# EAGLE design ledboard_smallcon (EAGLE 6.4)
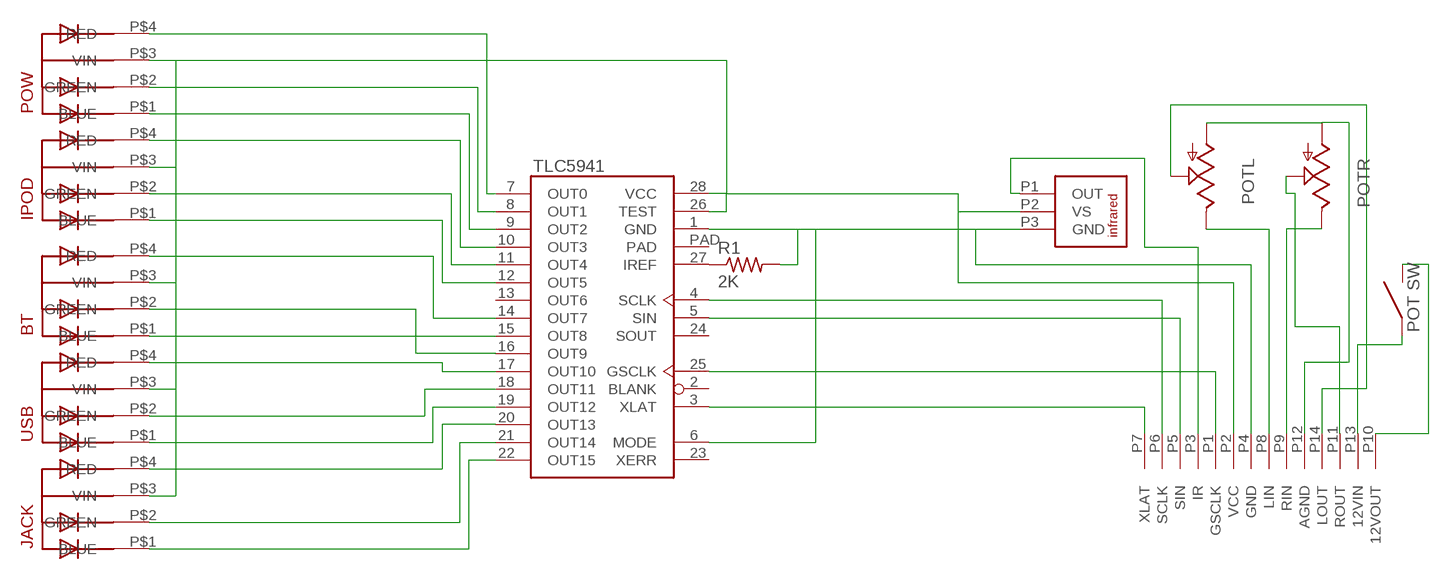
[diagram p0: schematic, sheet 1]

## Parts
BT  5MMRGBLEDBENT  [BENTLED]
IPOD  5MMRGBLEDBENT  [BENTLED]
IR  TSOP323  [TSOP323]
JACK  5MMRGBLEDBENT  [BENTLED]
POT  ALPS_RK0971221Z0N  [ALPS_RK0971221Z0X]
POW  5MMRGBLEDBENT  [BENTLED]
R1  2K  R-US_0207/7  [0207/7]
U$1  TLC5941  [HTSSOP28_POWERPAD]
U$3  CONNECTORSMALL  [CON2]
USB  5MMRGBLEDBENT  [BENTLED]

## Nets
N$1: BT.P$3(VIN) IPOD.P$3(VIN) IR.P2(VS) JACK.P$3(VIN) POW.P$3(VIN) U$1.26(TEST) U$1.28(VCC) U$3.P2(VCC) USB.P$3(VIN)
N$2: POW.P$4(RED) U$1.7(OUT0)
N$3: POW.P$2(GREEN) U$1.8(OUT1)
N$4: POW.P$1(BLUE) U$1.9(OUT2)
N$5: IPOD.P$4(RED) U$1.10(OUT3)
N$6: IPOD.P$2(GREEN) U$1.11(OUT4)
N$7: IPOD.P$1(BLUE) U$1.12(OUT5)
N$8: BT.P$4(RED) U$1.14(OUT7)
N$9: BT.P$1(BLUE) U$1.15(OUT8)
N$10: U$1.19(OUT12) USB.P$1(BLUE)
N$11: JACK.P$1(BLUE) U$1.22(OUT15)
N$12: BT.P$2(GREEN) U$1.16(OUT9)
N$13: U$1.17(OUT10) USB.P$4(RED)
N$14: U$1.4(SCLK) U$3.P6(SCLK)
N$15: JACK.P$4(RED) U$1.20(OUT13)
N$16: POT.G1 POT.G2 U$3.P12(AGND)
N$17: U$1.18(OUT11) USB.P$2(GREEN)
N$18: JACK.P$2(GREEN) U$1.21(OUT14)
N$19: R1.1 U$1.27(IREF)
N$20: IR.P3(GND) R1.2 U$1.1(GND) U$1.6(MODE) U$3.P4(GND)
N$21: U$1.5(SIN) U$3.P5(SIN)
N$22: IR.P1(OUT) U$3.P3(IR)
N$23: POT.I1 U$3.P8(LIN)
N$24: U$1.25(GSCLK) U$3.P1(GSCLK)
N$25: U$1.3(XLAT) U$3.P7(XLAT)
N$26: POT.I2 U$3.P9(RIN)
N$27: POT.O1 U$3.P14(LOUT)
N$28: POT.O2 U$3.P11(ROUT)
N$29: POT.S1 U$3.P13(12VIN)
N$30: POT.S2 U$3.P10(12VOUT)
Unconnected: U$1.2(BLANK) U$1.13(OUT6) U$1.23(XERR) U$1.24(SOUT) U$1.PAD

## Library data of the parts
BT IPOD JACK POW USB = led_rgb:5MMRGBLED
IR = tsop321:TSOP323
POT = audio-pots:ALPS_RK0971221Z0*: ALPS RK0971221Z Dual-gang 9mm potentiometer for volume control, with SPST switch -05 model: 10K with "volume" taper -0N model: 50K with traditional audio taper
R1 = resistor:R-US_: RESISTOR, American symbol
U$1 = tlc594X:TLC5941
U$3 = connector:CONNECTOR

## Board
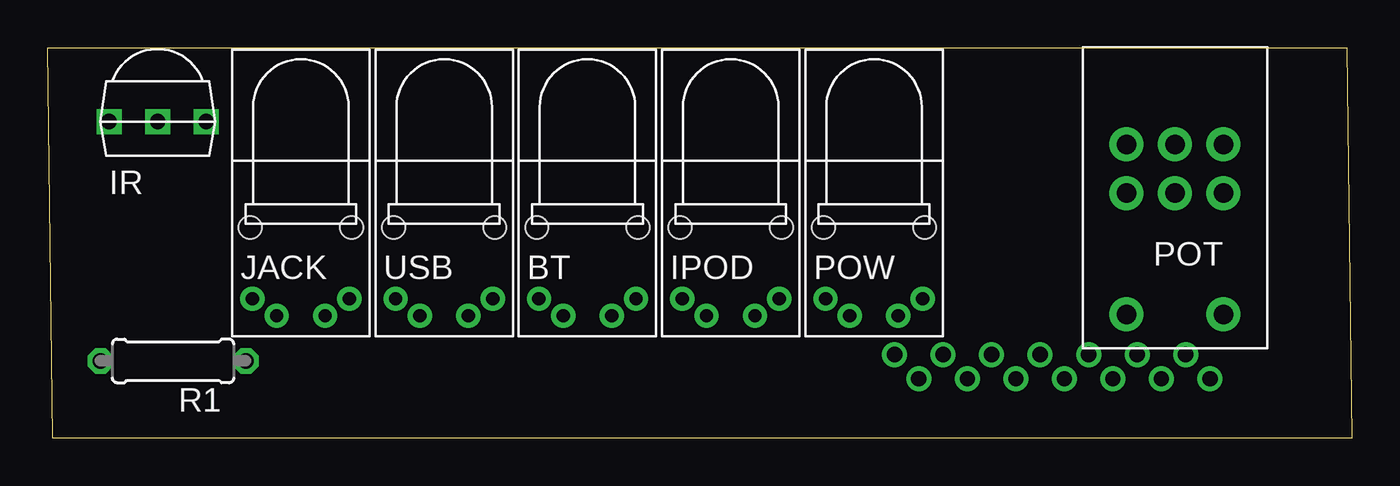
[diagram p1: board, top side]
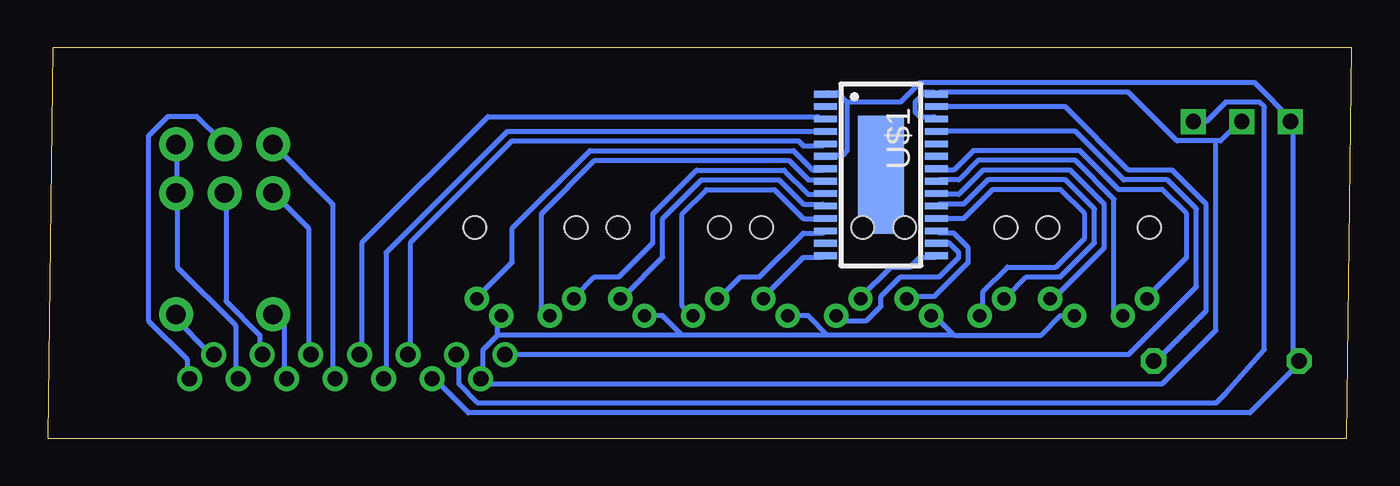
[diagram p2: board, bottom side, seen from below]

Size 68.25 x 20.43 mm. Coordinates in mm from the lower left corner, seen from the top.
Outline: 0.25,0 0,20.43 68,20.43 68.25,0 0.25,0
Copper layers (1*16): Top 0.035mm / dielectric 1.5mm / Bottom 0.035mm
Design rules "default *": minimum track width 10mil, minimum drill 24mil, track to track 8mil, track to pad 8mil, pad to pad 8mil, via to via 8mil, smd to smd 8mil, copper to edge 40mil, drill to drill 8mil, minimum pad ring 10mil, minimum via ring 8mil, stop-mask expansion 4mil, vias tented up to drill 0mil, thermal gap 10mil

### Footprints (pad centres in the part's own frame; a part is rotated, then mirrored left to right if it is on the bottom)
BENTLED = drill 0.7 pad 1.27: P$1 -2.54,-0.381; P$2 -1.27,-1.27; P$3 1.27,-1.27; P$4 2.54,-0.381 | hole 1.2: -2.65,3.35; 2.65,3.35
TSOP323 = drill 0.8 square: P1 2.54,0; P2 0,0; P3 -2.54,0
ALPS_RK0971221Z0X = drill 1.016 pad 1.778: G1 2.54,-2.54; G2 0,-2.54; I1 2.54,2.54; I2 0,2.54; O1 2.54,0; O2 0,0; S1 -6.35,-2.54; S2 -6.35,2.54
0207/7 = drill 0.813 octagon: 1 -3.81,0; 2 3.81,0
HTSSOP28_POWERPAD = smd 0.35 x 1.2: 1 -4.225,-2.9; 2 -3.575,-2.9; 3 -2.925,-2.9; 4 -2.275,-2.9; 5 -1.625,-2.9; 6 -0.975,-2.9; 7 -0.325,-2.9; 8 0.325,-2.9; 9 0.975,-2.9; 10 1.625,-2.9; 11 2.275,-2.9; 12 2.925,-2.9; 13 3.575,-2.9; 14 4.225,-2.9; 15 4.225,2.9; 16 3.575,2.9; 17 2.925,2.9; 18 2.275,2.9; 19 1.625,2.9; 20 0.975,2.9; 21 0.325,2.9; 22 -0.325,2.9; 23 -0.975,2.9; 24 -1.625,2.9; 25 -2.275,2.9; 26 -2.925,2.9; 27 -3.575,2.9; 28 -4.225,2.9 | smd 6.17 x 2.4: PAD 0,0
CON2 = drill 0.8: P1 -10.795,1.27; P2 -9.525,0; P3 -8.255,1.27; P4 -6.985,0; P5 -5.715,1.27; P6 -4.445,0; P7 -3.175,1.27; P8 -1.905,0; P9 -0.635,1.27; P10 0.635,0; P11 1.905,1.27; P12 3.175,0; P13 4.445,1.27; P14 5.715,0

### Placement (x,y rotation side)
BT  28.25,7.68 0 top
IPOD  35.75,7.68 0 top
IR  5.75,16.57 0 top
JACK  13.25,7.68 0 top
POT  59,12.83 90 top
POW  43.25,7.68 0 top
R1  6.56,4.04 180 top
U$1  24.64,13.77 270 bottom
U$3  55.12,3.11 0 top
USB  20.75,7.68 0 top

### Tracks (layer width: path | path; a pad name or v marks a point on that pad's centre or on a via)
N$1
  Bottom 0.254: U$1.26 21.84,16.82 22.61,16.82 22.86,17.08 22.86,17.58 22.35,18.09 21.84,18.09 U$1.28 21.59,18.09 11.68,18.09 9.14,15.55 7.11,15.55 | 7.11,15.55 6.86,15.55 5.84,16.57 IR.P2 | 44.7,5.39 44.7,6.41 POW.P$3 | 44.7,5.39 45.47,4.63 45.47,3.11 | JACK.P$3 15.24,6.41 16.26,5.39 20.83,5.39 | 20.83,5.39 21.84,6.41 USB.P$3 | BT.P$3 28.45,6.41 27.43,5.39 | 20.83,5.39 27.43,5.39 | IPOD.P$3 36.07,6.41 35.05,5.39 | 27.43,5.39 35.05,5.39 | 35.05,5.39 44.7,5.39 | 7.11,15.55 7.11,5.65 9.91,2.85 45.21,2.85 45.47,3.11 | 45.47,3.11 U$3.P2
N$2
  Bottom 0.254: U$1.7 27.69,14.03 28.19,14.03 29.21,15.04 39.88,15.04 43.94,10.98 43.94,9.2 45.72,7.42 POW.P$4
N$3
  Bottom 0.254: U$1.8 27.69,13.52 28.45,13.52 29.46,14.54 39.62,14.54 42.42,11.74 42.42,6.66 42.16,6.41 POW.P$2
N$4
  Bottom 0.254: U$1.9 27.69,12.76 28.45,12.76 29.72,14.03 34.29,14.03 36.58,11.74 36.58,10.22 38.35,8.44 39.62,8.44 40.64,7.42 POW.P$1
N$5
  Bottom 0.254: U$1.10 27.69,12.25 28.7,12.25 29.97,13.52 34.04,13.52 36.07,11.49 36.07,9.46 38.1,7.42 IPOD.P$4
N$6
  Bottom 0.254: U$1.11 27.69,11.49 28.7,11.49 30.23,13.01 33.78,13.01 35.05,11.74 35.05,6.92 34.54,6.41 IPOD.P$2
N$7
  Bottom 0.254: U$1.12 27.69,10.73 28.7,10.73 30.99,8.44 32,8.44 33.02,7.42 IPOD.P$1
N$8
  Bottom 0.254: U$1.14 27.69,9.46 28.7,9.46 30.73,7.42 BT.P$4
N$9
  Bottom 0.254: U$1.15 21.84,9.46 22.61,9.46 23.11,8.95 24.13,8.95 25.65,7.42 BT.P$1
N$10
  Bottom 0.254: U$1.19 21.59,12.25 20.32,12.25 19.05,13.52 14.99,13.52 13.46,12 13.46,10.22 15.24,8.44 17.02,8.44 18.03,7.42 USB.P$1
N$11
  Bottom 0.254: U$1.22 21.59,14.03 20.83,14.03 19.81,15.04 14.22,15.04 12.19,13.01 9.91,13.01 8.64,11.74 8.64,9.46 10.67,7.42 JACK.P$1
N$12
  Bottom 0.254: U$1.16 21.59,10.22 21.08,10.22 20.57,9.71 20.57,9.46 21.59,8.44 23.62,8.44 24.64,7.42 24.64,6.92 25.4,6.15 26.67,6.15 26.92,6.41 BT.P$2
N$13
  Bottom 0.254: U$1.17 21.59,10.73 20.83,10.73 20.07,9.96 20.07,9.2 21.84,7.42 23.11,7.42 USB.P$4
N$14
  Bottom 0.254: U$1.4 27.69,16.06 44.2,16.06 50.55,9.71 50.55,3.11 U$3.P6
N$15
  Bottom 0.254: U$1.20 21.59,12.76 20.57,12.76 19.3,14.03 14.73,14.03 12.95,12.25 12.95,9.96 15.75,7.17 JACK.P$4
N$16
  Bottom 0.254: U$3.P12 58.42,3.11 58.42,5.9 61.47,8.95 61.47,12.76 POT.G2 61.47,13.01 61.47,15.3 POT.G1
N$17
  Bottom 0.254: U$1.18 21.59,11.49 20.32,11.49 18.8,13.01 15.24,13.01 13.97,11.74 13.97,10.47 15.49,8.95 18.03,8.95 19.3,7.68 19.3,6.41 USB.P$2
N$18
  Bottom 0.254: U$1.21 21.59,13.52 20.57,13.52 19.56,14.54 14.48,14.54 12.45,12.5 12.45,6.66 12.19,6.41 JACK.P$2
N$19
  Bottom 0.254: U$1.27 21.59,17.33 14.99,17.33 11.68,14.03 9.4,14.03 7.62,12.25 7.62,6.66 10.16,4.12 R1.1
N$20
  Bottom 0.254: 3.05,16.57 5.08,18.6 22.61,18.6 23.62,17.58 26.42,17.58 | 27.43,18.09 U$1.1 | 3.05,3.61 2.79,3.87 R1.2 3.05,3.61 | 3.05,3.61 5.33,1.33 46.23,1.33 48.01,3.11 U$3.P4 | 3.05,3.61 3.05,16.57 | 3.05,16.57 IR.P3 | 26.92,14.79 26.67,14.79 26.42,15.04 26.42,17.58 | 26.42,17.58 26.92,18.09 26.92,18
  Bottom 0.305: U$1.1 26.92,18 26.83,18 | 26.92,14.79 27.5,14.79 U$1.6
N$21
  Bottom 0.254: U$1.5 27.69,15.3 28.7,15.3 28.96,15.55 43.94,15.55 49.28,10.22 49.28,4.38 U$3.P5
N$22
  Bottom 0.254: IR.P1 7.62,16.57 6.6,17.58 4.83,17.58 4.57,17.33 4.57,4.63 6.6,2.34 7.11,1.84 45.72,1.84 46.74,2.85 46.74,4.38 U$3.P3
N$23
  Bottom 0.254: U$3.P8 53.34,3.11 53.34,12.25 56.39,15.3 POT.I1
N$24
  Bottom 0.254: U$1.25 21.59,16.06 14.48,16.06 11.94,13.52 9.65,13.52 8.13,12 8.13,7.93 11.68,4.38 U$3.P1
N$25
  Bottom 0.254: U$1.3 27.94,16.82 45.21,16.82 51.82,10.22 51.82,4.38 U$3.P7
N$26
  Bottom 0.254: U$3.P9 54.61,4.38 54.61,10.98 56.39,12.76 POT.I2
N$27
  Bottom 0.254: U$3.P14 60.96,3.11 60.96,4.12 62.99,6.15 62.99,15.81 61.98,16.82 60.45,16.82 59.18,15.55 POT.O1
N$28
  Bottom 0.254: U$3.P11 57.15,4.38 57.15,5.39 58.93,7.17 58.93,12.76 POT.O2
N$29
  Bottom 0.254: U$3.P13 59.69,4.38 61.72,6.41 POT.S1
N$30
  Bottom 0.254: U$3.P10 55.88,3.11 55.88,5.9 56.39,6.41 POT.S2